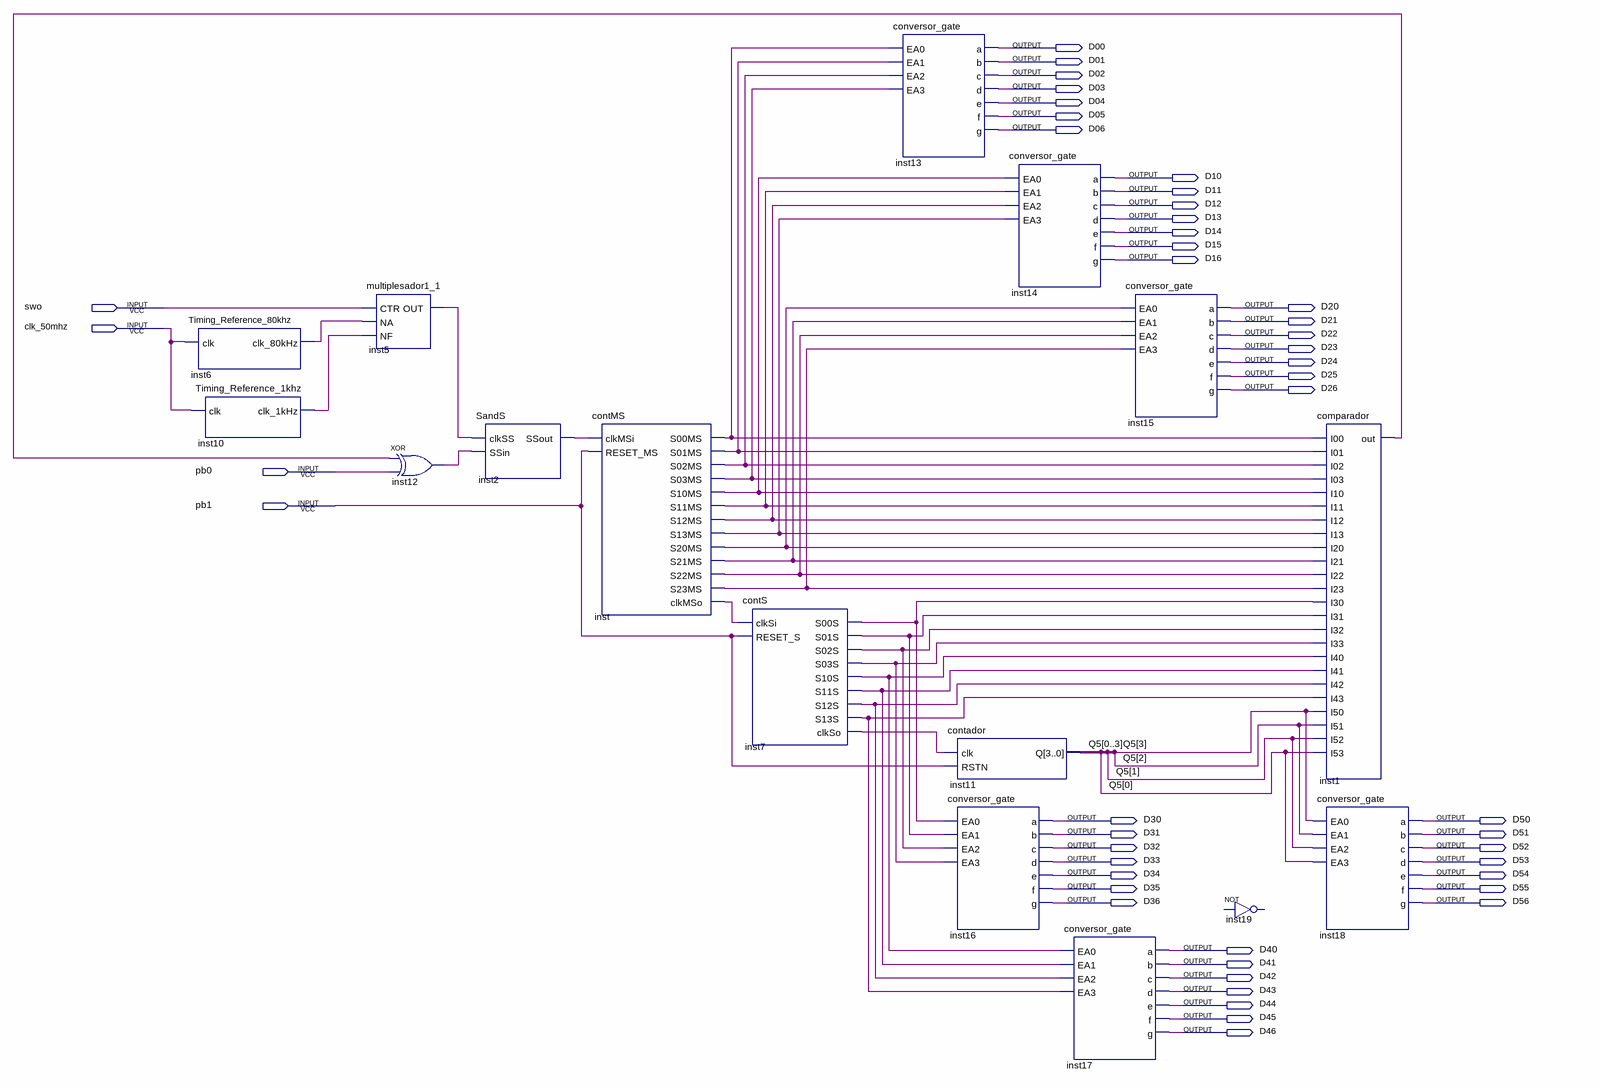
[diagram p0: schematic sheet]
// Quartus schematic cronometro.bdf as structural Verilog: 16 symbols, 46 pins
module cronometro (
  input  swo,
  input  clk_50mhz,
  input  pb0,
  input  pb1,
  output D00,
  output D01,
  output D02,
  output D03,
  output D04,
  output D05,
  output D06,
  output D10,
  output D11,
  output D12,
  output D13,
  output D14,
  output D15,
  output D16,
  output D20,
  output D21,
  output D22,
  output D23,
  output D24,
  output D25,
  output D26,
  output D30,
  output D50,
  output D31,
  output D51,
  output D32,
  output D52,
  output D33,
  output D53,
  output D34,
  output D54,
  output D35,
  output D55,
  output D36,
  output D56,
  output D40,
  output D41,
  output D42,
  output D43,
  output D44,
  output D45,
  output D46
);

  wire inst1_out, inst2_ssout, inst5_out, inst6_clk_80khz, inst7_clkso, inst7_s00s, inst7_s01s, inst7_s02s,
       inst7_s03s, inst7_s10s, inst7_s11s, inst7_s12s, inst7_s13s, inst10_clk_1khz, inst12_out, inst_clkmso,
       inst_s00ms, inst_s01ms, inst_s02ms, inst_s03ms, inst_s10ms, inst_s11ms, inst_s12ms, inst_s13ms,
       inst_s20ms, inst_s21ms, inst_s22ms, inst_s23ms;
  wire [3:0] Q5;

  Timing_Reference_80khz inst6 (.clk(clk_50mhz), .clk_80kHz(inst6_clk_80khz));
  Timing_Reference_1khz inst10 (.clk(clk_50mhz), .clk_1kHz(inst10_clk_1khz));
  multiplesador1_1 inst5 (.CTR(swo), .NA(inst6_clk_80khz), .NF(inst10_clk_1khz), .OUT(inst5_out));
  xor inst12 (inst12_out, inst1_out, pb0);
  SandS inst2 (.clkSS(inst5_out), .SSin(inst12_out), .SSout(inst2_ssout));
  contMS inst (
    .clkMSi(inst2_ssout), .RESET_MS(pb1), .S00MS(inst_s00ms), .S01MS(inst_s01ms), .S02MS(inst_s02ms),
    .S03MS(inst_s03ms), .S10MS(inst_s10ms), .S11MS(inst_s11ms), .S12MS(inst_s12ms), .S13MS(inst_s13ms),
    .S20MS(inst_s20ms), .S21MS(inst_s21ms), .S22MS(inst_s22ms), .S23MS(inst_s23ms), .clkMSo(inst_clkmso));
  contS inst7 (
    .clkSi(inst_clkmso), .RESET_S(pb1), .S00S(inst7_s00s), .S01S(inst7_s01s), .S02S(inst7_s02s),
    .S03S(inst7_s03s), .S10S(inst7_s10s), .S11S(inst7_s11s), .S12S(inst7_s12s), .S13S(inst7_s13s),
    .clkSo(inst7_clkso));
  conversor_gate inst13 (
    .EA0(inst_s00ms), .EA1(inst_s01ms), .EA2(inst_s02ms), .EA3(inst_s03ms), .a(D00), .b(D01), .c(D02),
    .d(D03), .e(D04), .f(D05), .g(D06));
  contador inst11 (.clk(inst7_clkso), .RSTN(pb1), .Q({Q5[0], Q5[1], Q5[2], Q5[3]}));
  conversor_gate inst16 (
    .EA0(inst7_s00s), .EA1(inst7_s01s), .EA2(inst7_s02s), .EA3(inst7_s03s), .a(D30), .b(D31), .c(D32),
    .d(D33), .e(D34), .f(D35), .g(D36));
  conversor_gate inst14 (
    .EA0(inst_s10ms), .EA1(inst_s11ms), .EA2(inst_s12ms), .EA3(inst_s13ms), .a(D10), .b(D11), .c(D12),
    .d(D13), .e(D14), .f(D15), .g(D16));
  conversor_gate inst17 (
    .EA0(inst7_s10s), .EA1(inst7_s11s), .EA2(inst7_s12s), .EA3(inst7_s13s), .a(D40), .b(D41), .c(D42),
    .d(D43), .e(D44), .f(D45), .g(D46));
  conversor_gate inst15 (
    .EA0(inst_s20ms), .EA1(inst_s21ms), .EA2(inst_s22ms), .EA3(inst_s23ms), .a(D20), .b(D21), .c(D22),
    .d(D23), .e(D24), .f(D25), .g(D26));
  // NOT inst19 is placed but not wired
  comparador inst1 (
    .I00(inst_s00ms), .I01(inst_s01ms), .I02(inst_s02ms), .I03(inst_s03ms), .I10(inst_s10ms),
    .I11(inst_s11ms), .I12(inst_s12ms), .I13(inst_s13ms), .I20(inst_s20ms), .I21(inst_s21ms),
    .I22(inst_s22ms), .I23(inst_s23ms), .I30(inst7_s00s), .I31(inst7_s01s), .I32(inst7_s02s),
    .I33(inst7_s03s), .I40(inst7_s10s), .I41(inst7_s11s), .I42(inst7_s12s), .I43(inst7_s13s), .I50(Q5[3]),
    .I51(Q5[2]), .I52(Q5[1]), .I53(Q5[0]), .out(inst1_out));
  conversor_gate inst18 (
    .EA0(Q5[3]), .EA1(Q5[2]), .EA2(Q5[1]), .EA3(Q5[0]), .a(D50), .b(D51), .c(D52), .d(D53), .e(D54), .f(D55),
    .g(D56));
endmodule
